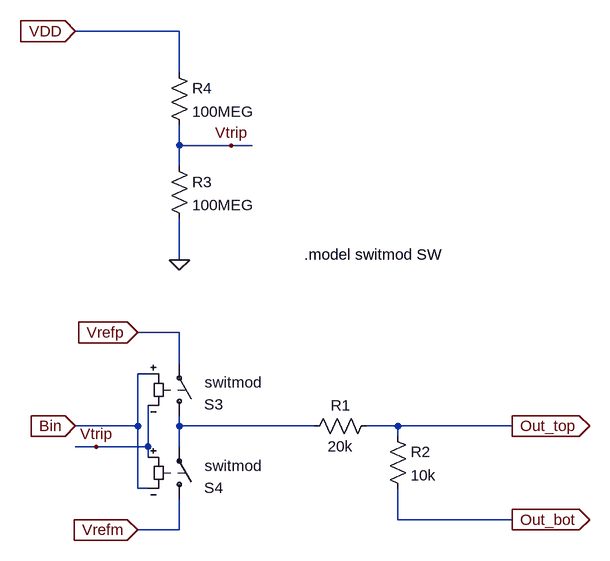
[diagram p0: schematic ADC_R_2R_bit.asc]
ADC_R_2R_bit.asc, the LTspice schematic file:
Version 4
SHEET 1 2740 696
WIRE 944 -752 912 -752
WIRE 1008 -784 912 -784
WIRE 1008 -784 1008 -864
WIRE 1008 -688 1008 -784
WIRE 1024 -864 1008 -864
WIRE 1024 -752 944 -752
WIRE 1024 -752 1024 -816
WIRE 1024 -736 1024 -752
WIRE 1024 -688 1008 -688
WIRE 1072 -1392 912 -1392
WIRE 1072 -1328 1072 -1392
WIRE 1072 -1216 1072 -1248
WIRE 1072 -1184 1072 -1216
WIRE 1072 -1040 1072 -1104
WIRE 1072 -928 1008 -928
WIRE 1072 -880 1072 -928
WIRE 1072 -784 1072 -800
WIRE 1072 -752 1072 -784
WIRE 1072 -624 1008 -624
WIRE 1072 -624 1072 -672
WIRE 1152 -1216 1072 -1216
WIRE 1184 -1216 1152 -1216
WIRE 1280 -784 1072 -784
WIRE 1408 -784 1360 -784
WIRE 1408 -768 1408 -784
WIRE 1408 -640 1408 -688
WIRE 1584 -784 1408 -784
WIRE 1584 -640 1408 -640
FLAG 1152 -1216 Vtrip
FLAG 1072 -1040 0
FLAG 912 -1392 VDD
IOPIN 912 -1392 In
FLAG 1008 -624 Vrefm
IOPIN 1008 -624 In
FLAG 1008 -928 Vrefp
IOPIN 1008 -928 In
FLAG 912 -784 Bin
IOPIN 912 -784 In
FLAG 1584 -784 Out_top
IOPIN 1584 -784 Out
FLAG 1584 -640 Out_bot
IOPIN 1584 -640 Out
FLAG 944 -752 Vtrip
SYMBOL sw 1072 -784 M180
WINDOW 3 24 -12 Left 0
WINDOW 38 39 67 Left 0
WINDOW 0 38 33 Left 0
SYMATTR Value ""
SYMATTR SpiceModel switmod
SYMATTR InstName S3
SYMBOL sw 1072 -656 M180
WINDOW 3 24 -12 Left 0
WINDOW 38 39 67 Left 0
WINDOW 0 38 33 Left 0
SYMATTR Value ""
SYMATTR SpiceModel switmod
SYMATTR InstName S4
SYMBOL res 1376 -800 R90
WINDOW 0 0 56 VBottom 0
WINDOW 3 32 56 VTop 0
SYMATTR InstName R1
SYMATTR Value 20k
SYMBOL res 1392 -784 R0
SYMATTR InstName R2
SYMATTR Value 10k
SYMBOL res 1056 -1200 R0
SYMATTR InstName R3
SYMATTR Value 100MEG
SYMBOL res 1056 -1344 R0
SYMATTR InstName R4
SYMATTR Value 100MEG
TEXT 1264 -1048 Left 0 !.model switmod SW

The netlist it stands for:
* ADC_R_2R_bit.asc
S3 N001 Vrefp Bin Vtrip switmod
S4 Vrefm N001 Vtrip Bin switmod
R1 Out_top N001 20k
R2 Out_top Out_bot 10k
R3 Vtrip 0 100MEG
R4 VDD Vtrip 100MEG
.model switmod SW
.backanno
.end